# Altium schematic sheet GSM.SchDoc
size A
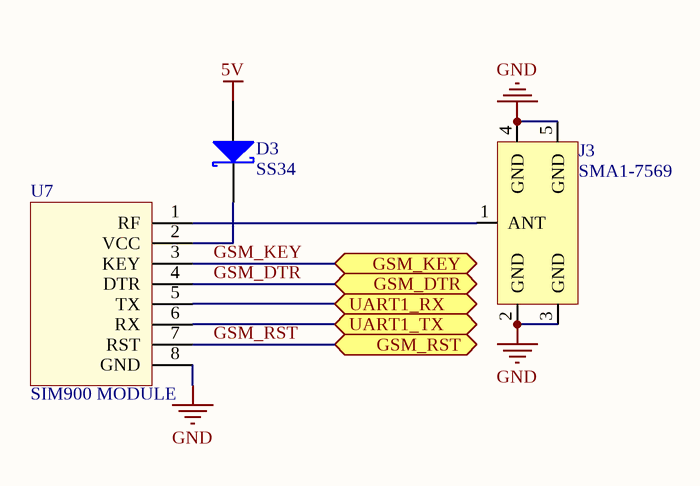
[diagram p0: GSM.SchDoc]

## Parts
D3  SS34  [DO-214AC (SMA)]
J3  SMA1-7569  [ANTENA STAND]
U7  SIM900 MODULE  [SIM900 DEMETER]

## Ports
GSM_DTR, GSM_KEY, GSM_RST, UART1_RX, UART1_TX

## Nets
5V: D3.1(A)
GND: J3.2(GND) J3.3(GND) J3.4(GND) J3.5(GND) U7.8(GND)
GSM_DTR: U7.4(DTR) ; port GSM_DTR
GSM_KEY: U7.3(KEY) ; port GSM_KEY
GSM_RST: U7.7(RST) ; port GSM_RST
UART1_RX: U7.5(TX) ; port UART1_RX
UART1_TX: U7.6(RX) ; port UART1_TX
NetD3_2: D3.2(K) U7.2(VCC)
NetJ3_1: J3.1(ANT) U7.1(RF)

## Library data of the parts
D3 = D Schottky: DIODE SCHOTTKY 40V 3A SMA; Manufacturer Part Number: B340A-E3/61T; Manufacturer: Vishay General Semiconductor; Published: 8-Jun-2000; LatestRevisionDate: 17-Jul-2002; LatestRevisionNote: Re-released for DXP Platform.; PackageReference: DO-214-AA; Publisher: Altium Limited; Code_JEDEC: DO-214-AA; Unit Price: 0.15840; Digi-Key Part Number: B340A-E3/61TGITR-ND
J3 = SMA-R/A-F: Unit Price: 0.5; Digi-Key Part Number: NA